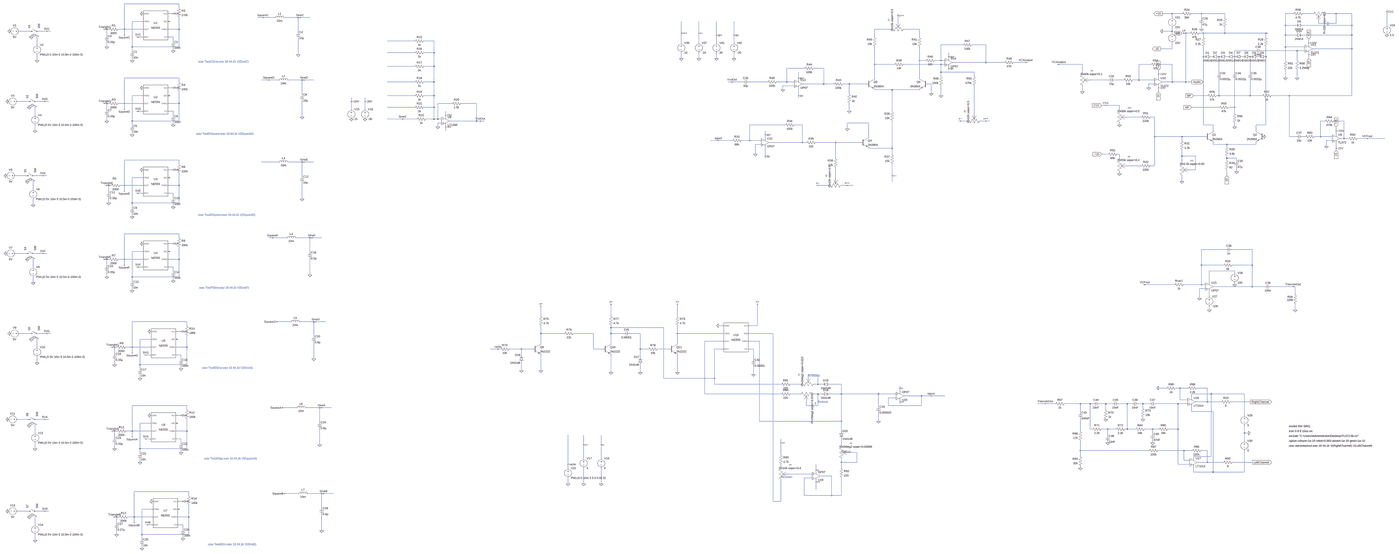
[diagram p0: schematic Test Case 1-Single Note.asc, whole sheet]
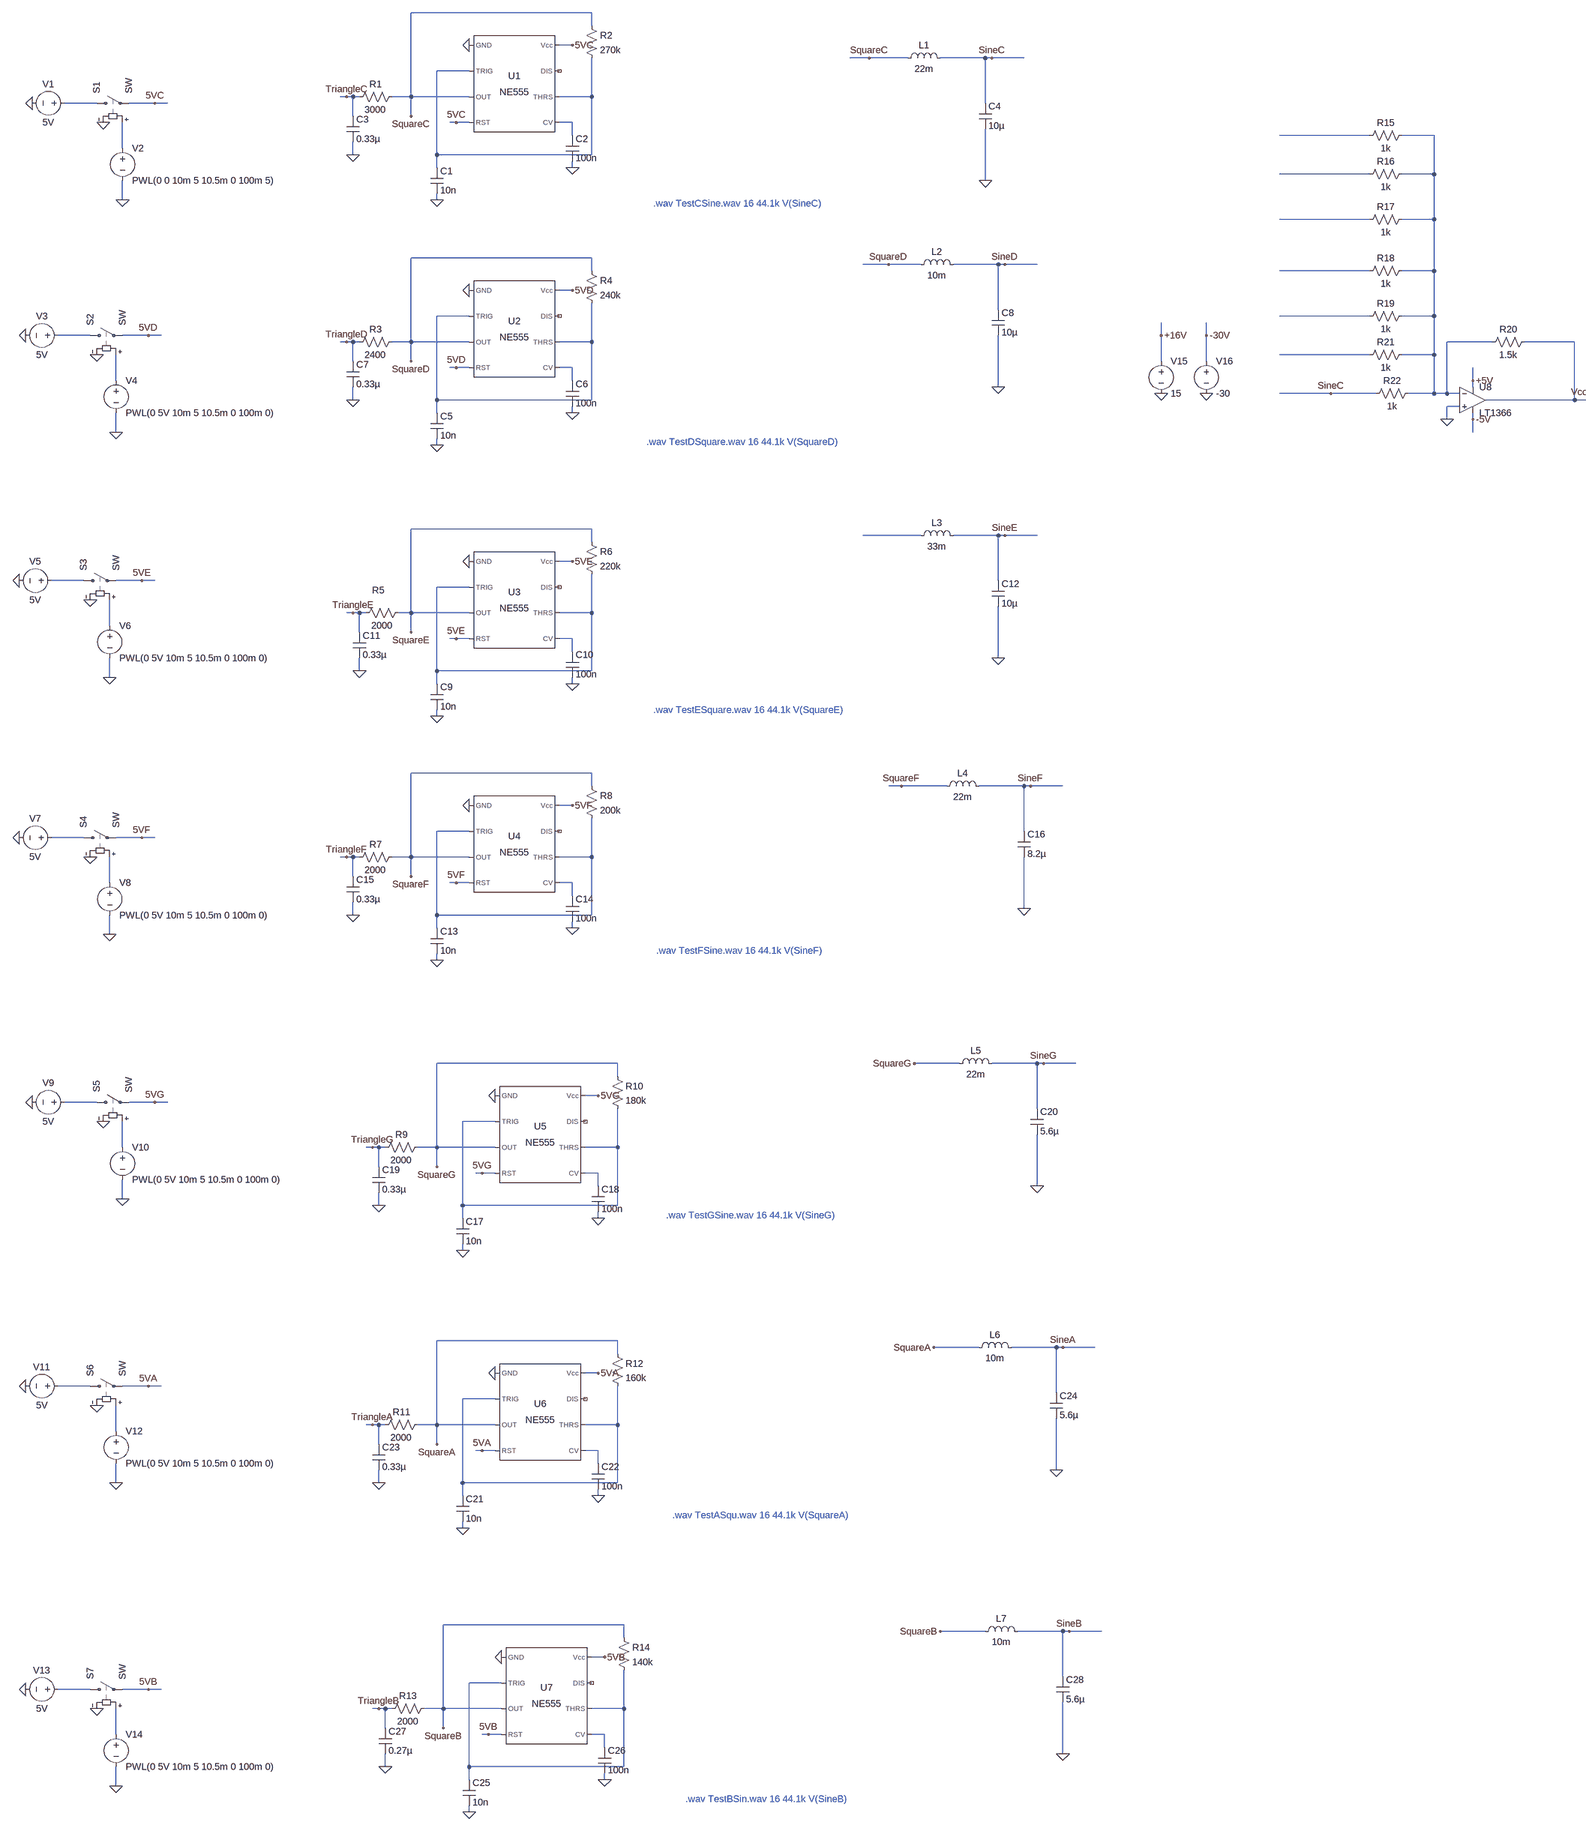
[diagram p1: schematic Test Case 1-Single Note.asc, part, row 1 of 1, column 1 of 3]
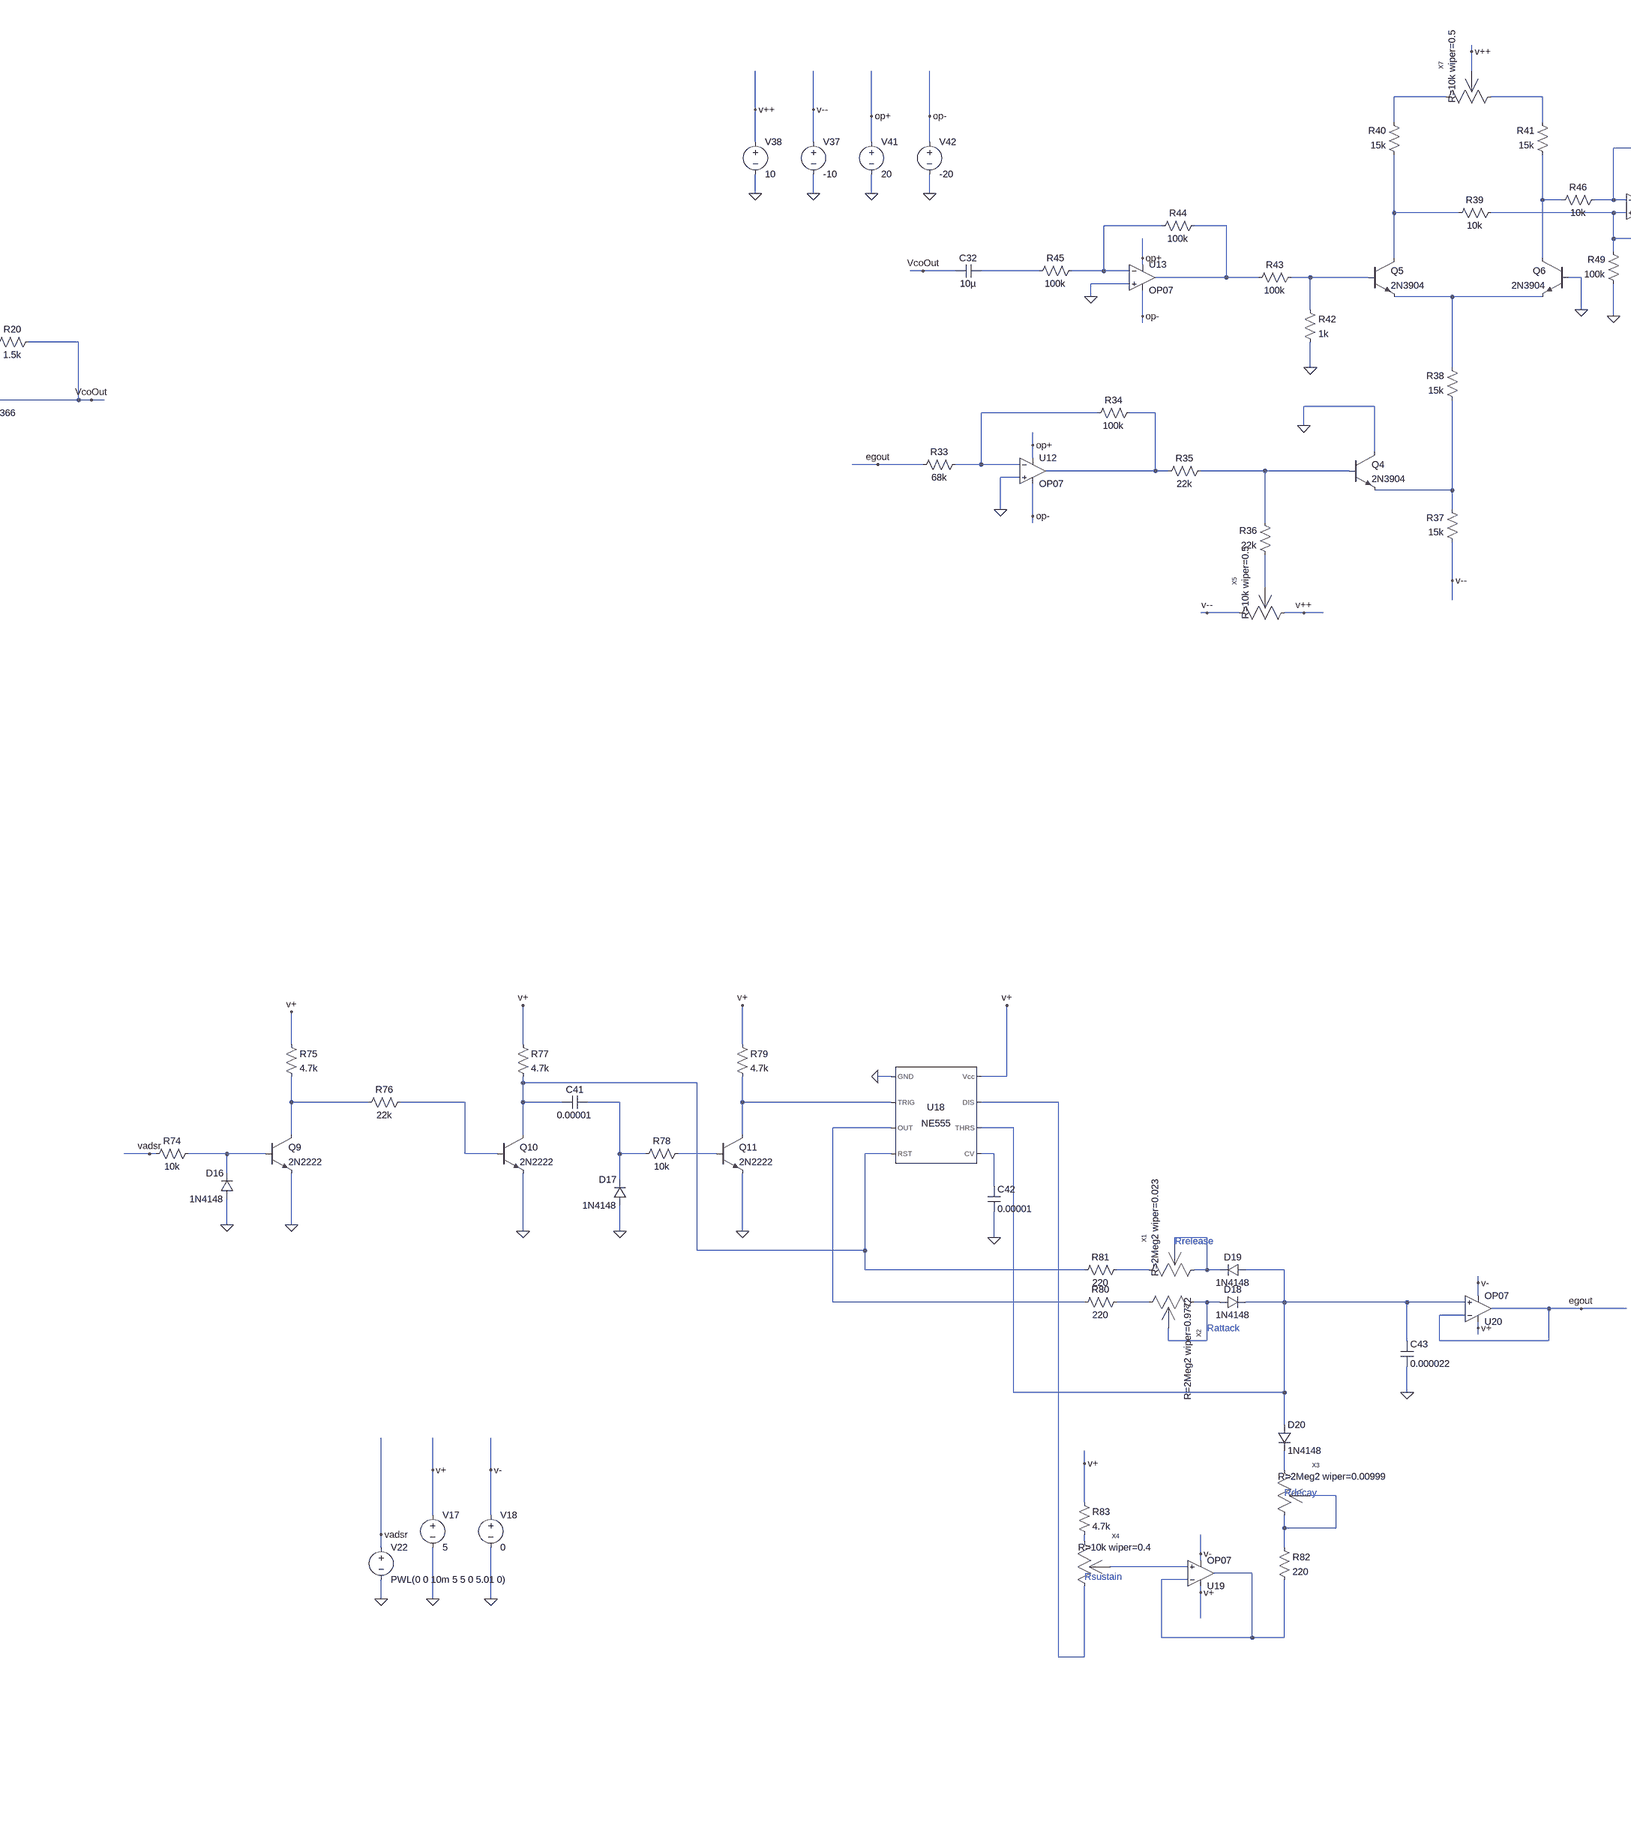
[diagram p2: schematic Test Case 1-Single Note.asc, part, row 1 of 1, column 2 of 3]
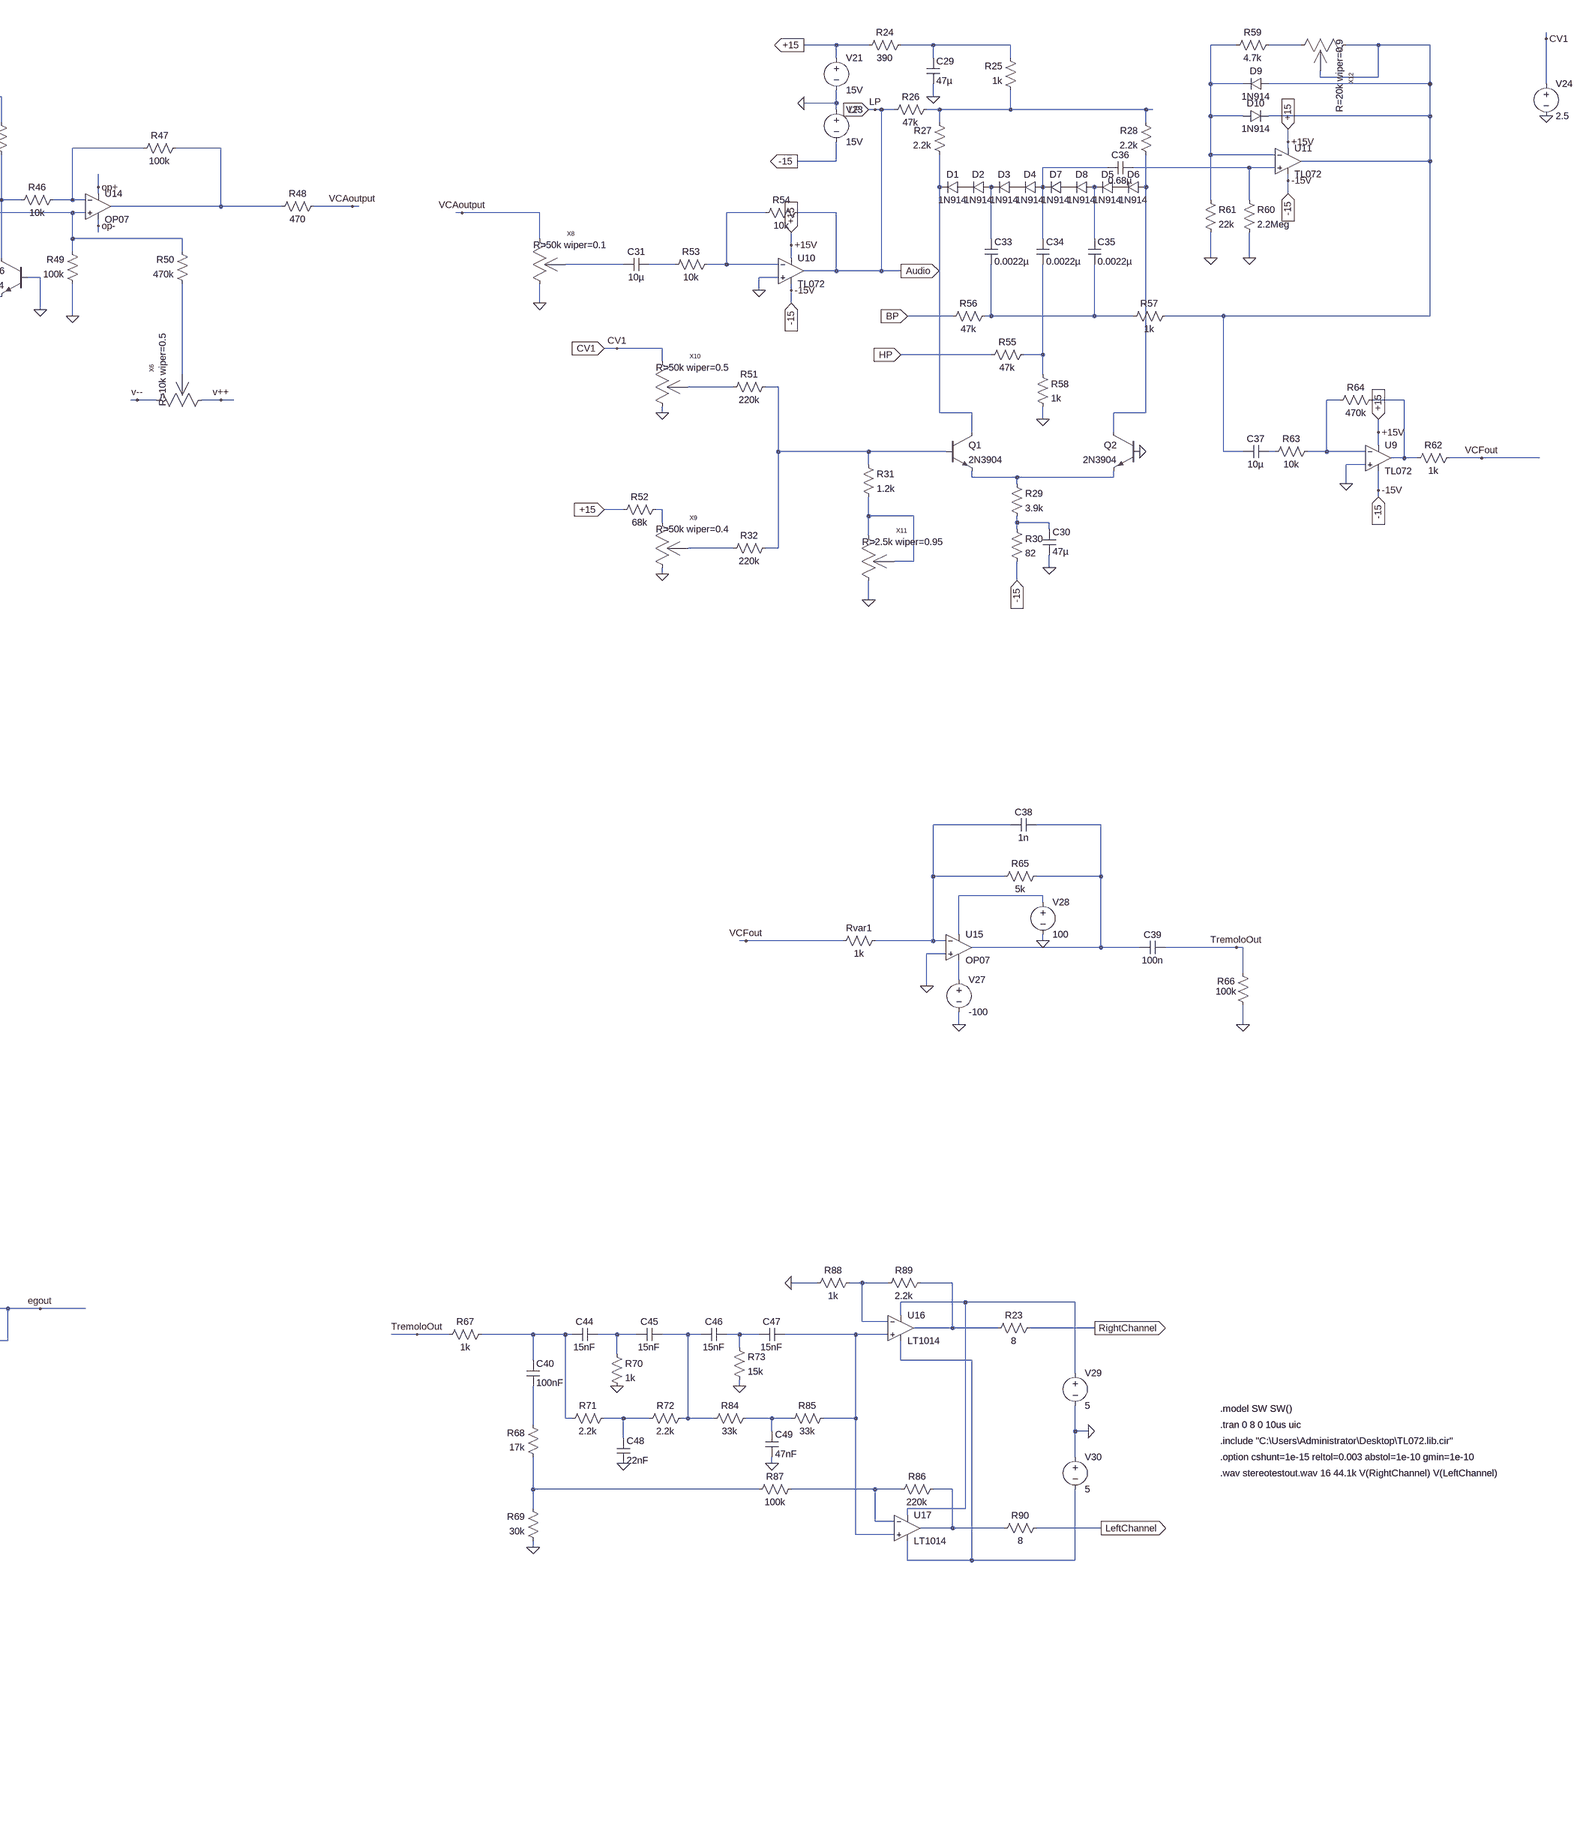
[diagram p3: schematic Test Case 1-Single Note.asc, part, row 1 of 1, column 3 of 3]
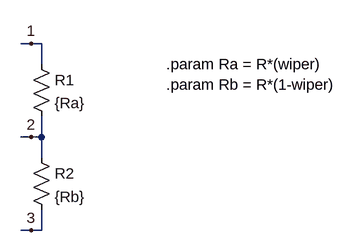
[diagram p4: sub-circuit varres.asc]
* Test Case 1-Single Note.asc
V17 v+ 0 5
V18 v- 0 0
V22 vadsr 0 PWL(0 0 10m 5 5 0 5.01 0)
XU12 0 N049 op+ op- N050 LT1001  ; OP07, pins In+ In- V+ V- OUT
XU13 0 N026 op+ op- N027 LT1001  ; OP07, pins In+ In- V+ V- OUT
XU14 N023 N014 op+ op- N015 LT1001  ; OP07, pins In+ In- V+ V- OUT
R33 N049 egout 68k
R34 N050 N049 100k
R35 N052 N050 22k
R36 N062 N052 22k
R37 v-- N054 15k
R38 N054 N035 15k
Q4 0 N052 N054 0 2N3904
Q5 N022 N034 N035 0 2N3904
Q6 N021 0 N035 0 2N3904
R39 N023 N022 10k
R40 N022 N006 15k
R41 N021 N007 15k
R42 N034 0 1k
R43 N034 N027 100k
R44 N027 N026 100k
R45 N026 N033 100k
C32 N033 VcoOut 10µ
R46 N014 N021 10k
R47 N015 N014 100k
R48 VCAoutput N015 470
R49 0 N023 100k
R50 N043 N023 470k
V37 v-- 0 -10
V38 v++ 0 10
XU1 0 N005 SquareC 5VC N010 N005 NC_01 5VC NE555  ; pins GND TRIG OUT RST CV THRS DIS Vcc
C1 N005 0 10n
R1 SquareC TriangleC 3000
C2 N010 0 100n
R2 SquareC N005 270k
C3 TriangleC 0 0.33µ
V1 N008 0 5V
L1 SquareC SineC 22m
C4 SineC 0 10µ
XU2 0 N036 SquareD 5VD N042 N036 NC_02 5VD NE555  ; pins GND TRIG OUT RST CV THRS DIS Vcc
C5 N036 0 10n
R3 SquareD TriangleD 2400
C6 N042 0 100n
R4 SquareD N036 240k
C7 TriangleD 0 0.33µ
L2 SquareD SineD 10m
C8 SineD 0 10µ
XU3 0 N061 SquareE 5VE N064 N061 NC_03 5VE NE555  ; pins GND TRIG OUT RST CV THRS DIS Vcc
C9 N061 0 10n
R5 SquareE TriangleE 2000
C10 N064 0 100n
R6 SquareE N061 220k
C11 TriangleE 0 0.33µ
L3 N058 SineE 33m
C12 SineE 0 10µ
XU4 0 N067 SquareF 5VF N070 N067 NC_04 5VF NE555  ; pins GND TRIG OUT RST CV THRS DIS Vcc
C13 N067 0 10n
R7 SquareF TriangleF 2000
C14 N070 0 100n
R8 SquareF N067 200k
C15 TriangleF 0 0.33µ
L4 SquareF SineF 22m
C16 SineF 0 8.2µ
XU5 0 N080 SquareG 5VG N087 N080 NC_05 5VG NE555  ; pins GND TRIG OUT RST CV THRS DIS Vcc
C17 N080 0 10n
R9 SquareG TriangleG 2000
C18 N087 0 100n
R10 SquareG N080 180k
C19 TriangleG 0 0.33µ
L5 SquareG SineG 22m
C20 SineG 0 5.6µ
XU6 0 N102 SquareA 5VA N107 N102 NC_06 5VA NE555  ; pins GND TRIG OUT RST CV THRS DIS Vcc
C21 N102 0 10n
R11 SquareA TriangleA 2000
C22 N107 0 100n
R12 SquareA N102 160k
C23 TriangleA 0 0.33µ
L6 SquareA SineA 10m
C24 SineA 0 5.6µ
XU7 0 N116 SquareB 5VB N119 N116 NC_07 5VB NE555  ; pins GND TRIG OUT RST CV THRS DIS Vcc
C25 N116 0 10n
R13 SquareB TriangleB 2000
C26 N119 0 100n
R14 SquareB N116 140k
C27 TriangleB 0 0.27µ
L7 SquareB SineB 10m
C28 SineB 0 5.6µ
S1 N008 5VC N013 0 SW
V2 N013 0 PWL(0 0 10m 5 10.5m 0 100m 5)
V3 N039 0 5V
S2 N039 5VD N044 0 SW
V4 N044 0 PWL(0 5V 10m 5 10.5m 0 100m 0)
V5 N060 0 5V
S3 N060 5VE N063 0 SW
V6 N063 0 PWL(0 5V 10m 5 10.5m 0 100m 0)
V7 N068 0 5V
S4 N068 5VF N069 0 SW
V8 N069 0 PWL(0 5V 10m 5 10.5m 0 100m 0)
V9 N074 0 5V
S5 N074 5VG N083 0 SW
V10 N083 0 PWL(0 5V 10m 5 10.5m 0 100m 0)
V11 N101 0 5V
S6 N101 5VA N106 0 SW
V12 N106 0 PWL(0 5V 10m 5 10.5m 0 100m 0)
V13 N117 0 5V
S7 N117 5VB N118 0 SW
V14 N118 0 PWL(0 5V 10m 5 10.5m 0 100m 0)
XU8 0 N012 +5V -5V VcoOut LT1366  ; pins In+ In- V+ V- OUT
R15 N012 N011 1k
R16 N012 N018 1k
R17 N012 N025 1k
R18 N012 N032 1k
R19 N012 N037 1k
V15 +16V 0 15
V16 -30V 0 -30
R20 VcoOut N012 1.5k
R21 N012 N040 1k
R22 N012 SineC 1k
V41 op+ 0 20
V42 op- 0 -20
R74 N084 vadsr 10k
D16 0 N084 1N4148
Q9 N075 N084 0 0 2N2222
R75 v+ N075 4.7k
R76 N076 N075 22k
Q10 N073 N076 0 0 2N2222
R77 v+ N073 4.7k
C41 N077 N073 0.00001
D17 0 N077 1N4148
R78 N085 N077 10k
Q11 N078 N085 0 0 2N2222
R79 v+ N078 4.7k
XU18 0 N078 N081 N073 N086 N082 N079 v+ NE555  ; pins GND TRIG OUT RST CV THRS DIS Vcc
R80 N092 N081 220
D18 N093 N082 1N4148
R81 N089 N073 220
D19 N082 N088 1N4148
D20 N082 N108 1N4148
R82 N112 N115 220
XU19 N114 N115 v+ v- N115 LT1001  ; OP07, pins In+ In- V+ V- OUT
R83 v+ N113 4.7k
C42 N086 0 0.00001
XU20 N082 egout v+ v- egout LT1001  ; OP07, pins In+ In- V+ V- OUT
C43 N082 0 0.000022
XX1 N088 N088 N089 varres params: R=2Meg2 wiper=0.023
XX2 N092 N093 N093 varres params: R=2Meg2 wiper=0.9772
XX3 N112 N112 N108 varres params: R=2Meg2 wiper=0.00999
XX4 N079 N114 N113 varres params: R=10k wiper=0.4
XX5 v++ N062 v-- varres params: R=10k wiper=0.5
XX6 v++ N043 v-- varres params: R=10k wiper=0.5
XX7 N007 v++ N006 varres params: R=10k wiper=0.5
V21 +15V 0 15V
V23 0 -15V 15V
R24 N001 +15V 390
R25 N009 N001 1k
C29 N001 0 47µ
R26 N009 LP 47k
R27 N019 N009 2.2k
R28 N020 N009 2.2k
D1 P001 N019 1N914
D2 N028 P001 1N914
D3 P002 N028 1N914
D4 N016 P002 1N914
D5 P003 N029 1N914
D6 N020 P003 1N914
Q1 N019 N046 N053 0 2N3904
Q2 N020 0 N053 0 2N3904
R29 N053 N057 3.9k
R30 N057 -15V 82
C30 N057 0 47µ
R31 N046 N056 1.2k
R32 N046 N059 220k
R51 N046 N045 220k
R52 N055 +15V 68k
R53 N024 N031 10k
R54 LP N024 10k
C31 N031 N030 10µ
D7 P004 N016 1N914
D8 N029 P004 1N914
R55 N041 HP 47k
R56 N038 BP 47k
C33 N028 N038 0.0022µ
C34 N016 N041 0.0022µ
C35 N029 N038 0.0022µ
R57 N004 N038 1k
C36 N017 N016 0.68µ
R58 N041 0 1k
D9 N004 N002 1N914
D10 N002 N004 1N914
R59 N003 N002 4.7k
R60 N017 0 2.2Meg
R61 N002 0 22k
R62 VCFout N048 1k
C37 N051 N004 10µ
R63 N047 N051 10k
R64 N048 N047 470k
XU9 0 N047 +15V -15V N048 TL072  ; pins In+ In- V+ V- OUT
XU10 0 N024 +15V -15V LP TL072  ; pins In+ In- V+ V- OUT
XU11 N017 N002 +15V -15V N004 TL072  ; pins In+ In- V+ V- OUT
V24 CV1 0 2.5
XX8 0 N030 VCAoutput varres params: R=50k wiper=0.1
XX9 0 N059 N055 varres params: R=50k wiper=0.4
XX10 0 N045 CV1 varres params: R=50k wiper=0.5
XX11 0 N056 N056 varres params: R=2.5k wiper=0.95
XX12 N003 N004 N004 varres params: R=20k wiper=0.9
Rvar1 N065 VCFout 1k
R65 N066 N065 5k
R66 0 TremoloOut 100k
C38 N066 N065 1n
C39 TremoloOut N066 100n
XU15 0 N065 N071 N072 N066 LT1001  ; OP07, pins In+ In- V+ V- OUT
V27 N072 0 -100
V28 N071 0 100
R67 N095 TremoloOut 1k
R68 N109 N105 17k
R69 0 N109 30k
C40 N095 N105 100nF
C44 N096 N095 15nF
C45 N097 N096 15nF
C46 N098 N097 15nF
C47 N099 N098 15nF
R70 N096 0 1k
R71 N103 N095 2.2k
R72 N097 N103 2.2k
C48 N103 0 22nF
R73 N098 0 15k
R84 N104 N097 33k
R85 N099 N104 33k
C49 N104 0 47nF
XU16 N099 N090 N094 N100 N091 LT1014  ; pins In+ In- V+ V- OUT
XU17 N099 N110 N094 N100 N111 LT1014  ; pins In+ In- V+ V- OUT
R86 N111 N110 220k
R87 N110 N109 100k
R88 N090 0 1k
R89 N091 N090 2.2k
V29 N094 0 5
V30 0 N100 5
R23 RightChannel N091 8
R90 LeftChannel N111 8

* block symbol definitions
.subckt varres 3 2 1
R1 1 2 {Ra}
R2 2 3 {Rb}
.param Ra = R*(wiper)
.param Rb = R*(1-wiper)
.ends varres

.model D D
.lib standard.dio
.model NPN NPN
.model PNP PNP
.lib standard.bjt
* .wav TestCSine.wav 16 44.1k V(SineC)
* .wav TestDSquare.wav 16 44.1k V(SquareD)
* .wav TestESquare.wav 16 44.1k V(SquareE)
* .wav TestFSine.wav 16 44.1k V(SineF)
* .wav TestGSine.wav 16 44.1k V(SineG)
* .wav TestASqu.wav 16 44.1k V(SquareA)
* .wav TestBSin.wav 16 44.1k V(SineB)
.model SW SW()
* Rattack
* Rrelease
* Rdecay
* Rsustain
.include "C:\Users\Administrator\Desktop\TL072.lib.cir"
.tran 0 8 0 10us uic
.option cshunt=1e-15 reltol=0.003 abstol=1e-10 gmin=1e-10
.wav stereotestout.wav 16 44.1k V(RightChannel) V(LeftChannel)
.lib LTC.lib
.lib NE555.sub
.backanno
.end